# EAGLE design PinJoy (EAGLE 6.1)
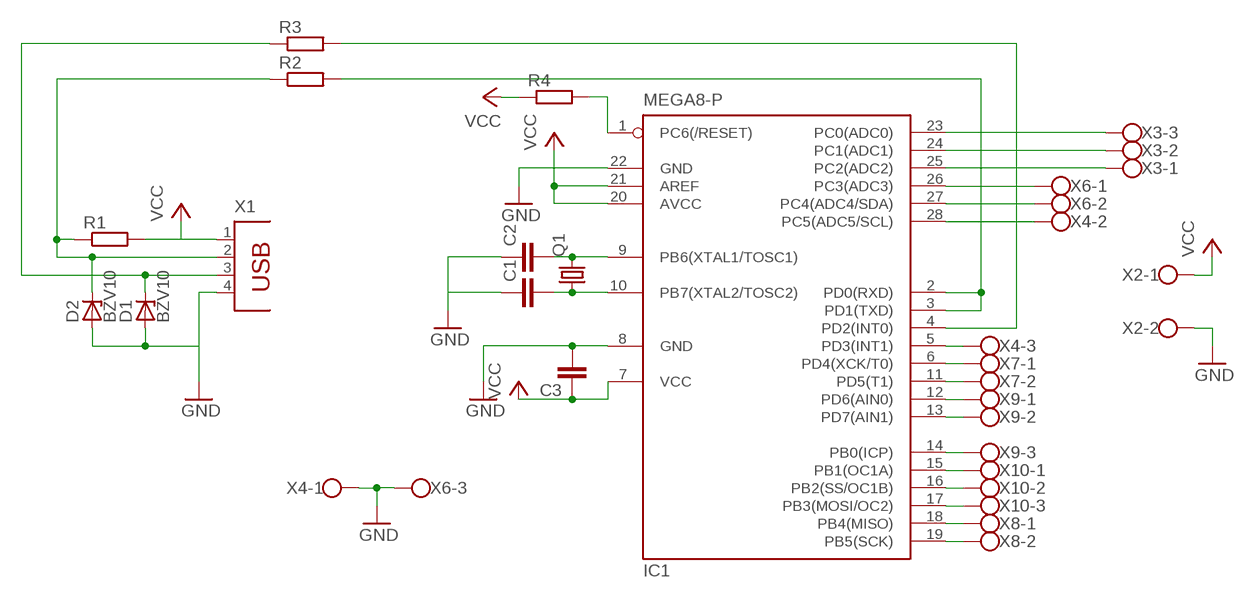
[diagram p0: schematic, sheet 1]

## Parts
C1  C-EU025-024X044  [C025-024X044]
C2  C-EU025-024X044  [C025-024X044]
C3  C-EU025-024X044  [C025-024X044]
D1  BZV10  [DO34Z7]
D2  BZV10  [DO34Z7]
IC1  MEGA8-P  [DIL28-3]
Q1  CRYSTALHC18U-V  [HC18U-V]
R1  R-EU_0204/7  [0204/7]
R2  R-EU_0204/7  [0204/7]
R3  R-EU_0204/7  [0204/7]
R4  R-EU_0204/7  [0204/7]
X1  PN61729  [PN61729]
X2  W237-102  [W237-102]
X3  W237-103  [W237-103]
X4  W237-103  [W237-103]
X6  W237-103  [W237-103]
X7  W237-102  [W237-102]
X8  W237-102  [W237-102]
X9  W237-103  [W237-103]
X10  W237-103  [W237-103]

## Nets
GND: C1.1 C2.1 C3.2 D1.A D2.A IC1.8(GND) IC1.22(GND) X1.4 X2.2 X4.1 X6.3
N$1: C2.2 IC1.9(PB6(XTAL1/TOSC1)) Q1.2
N$2: C1.2 IC1.10(PB7(XTAL2/TOSC2)) Q1.1
N$3: IC1.19(PB5(SCK)) X8.2
N$4: D2.C R1.1 R2.1 X1.2
N$5: IC1.2(PD0(RXD)) IC1.3(PD1(TXD)) R2.2
N$6: IC1.4(PD2(INT0)) R3.2
N$7: D1.C R3.1 X1.3
N$8: IC1.18(PB4(MISO)) X8.1
N$9: IC1.17(PB3(MOSI/OC2)) X10.3
N$10: IC1.25(PC2(ADC2)) X3.1
N$11: IC1.16(PB2(SS/OC1B)) X10.2
N$12: IC1.15(PB1(OC1A)) X10.1
N$13: IC1.24(PC1(ADC1)) X3.2
N$14: IC1.23(PC0(ADC0)) X3.3
N$15: IC1.26(PC3(ADC3)) X6.1
N$16: IC1.27(PC4(ADC4/SDA)) X6.2
N$17: IC1.13(PD7(AIN1)) X9.2
N$18: IC1.12(PD6(AIN0)) X9.1
N$19: IC1.11(PD5(T1)) X7.2
N$20: IC1.6(PD4(XCK/T0)) X7.1
N$21: IC1.5(PD3(INT1)) X4.3
N$22: IC1.28(PC5(ADC5/SCL)) X4.2
N$23: IC1.14(PB0(ICP)) X9.3
N$24: IC1.1(PC6(/RESET)) R4.2
VCC: C3.1 IC1.7(VCC) IC1.20(AVCC) IC1.21(AREF) R1.2 R4.1 X1.1 X2.1

## Library data of the parts
C1-C3 = rcl:C-EU: CAPACITOR, European symbol
D1 D2 = diode:BZV10: Z DIODE
IC1 = atmel:MEGA8-P: MICROCONTROLLER 8 Kbytes FLASH, 1 kbytes SRAM, 512 bytes EEPROM, USART, 4-channel 10 bit ADC, 2-channel 8 bit ADC Pin compatible with Atmega48, ATMega88, ATMega168 Source: avr.lbr; OC_FARNELL: unknown; OC_NEWARK: unknown
Q1 = crystal:CRYSTAL: CRYSTAL; OC_FARNELL: unknown; OC_NEWARK: unknown
R1-R4 = resistor:R-EU_: RESISTOR, European symbol
X1 = con-berg:PN61729: BERG USB connector; OC_FARNELL: unknown; OC_NEWARK: unknown
X2 X7 X8 = con-wago-500:W237-102: WAGO SCREW CLAMP; MPN: 237-102; OC_FARNELL: unknown; OC_NEWARK: 70K9898
X3 X4 X6 X9 X10 = con-wago-500:W237-103: WAGO SCREW CLAMP; MPN: 237-103; OC_FARNELL: unknown; OC_NEWARK: 18M7116

## Board
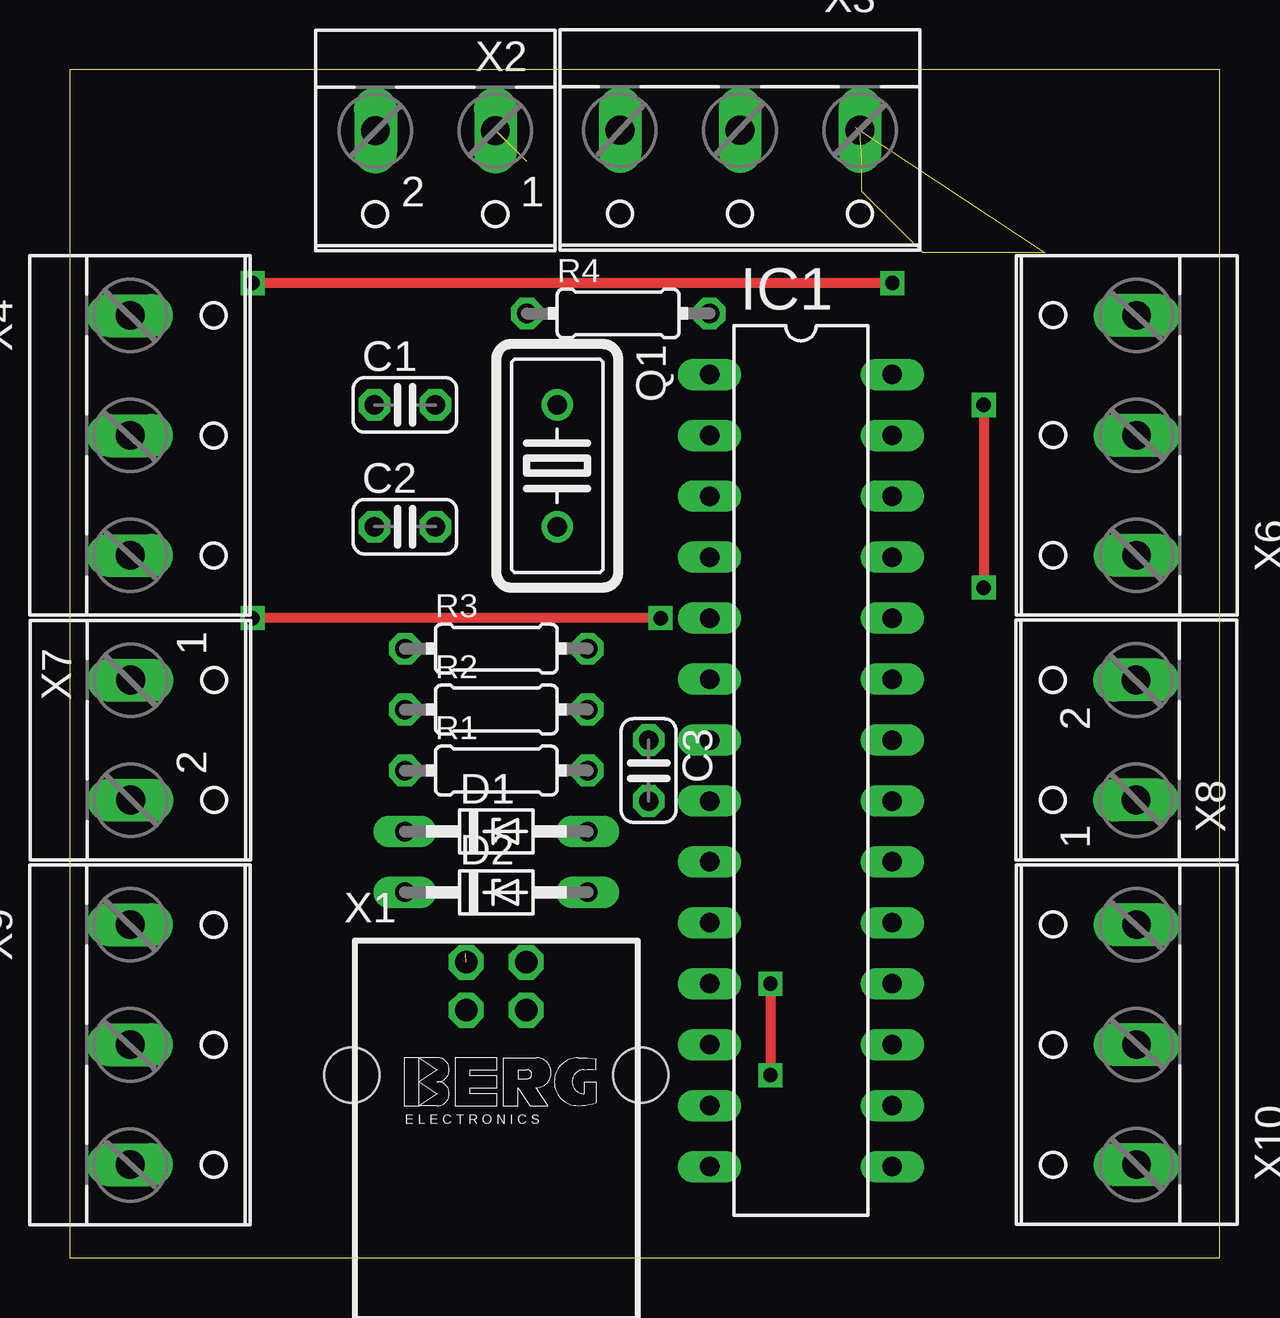
[diagram p1: board, top side]
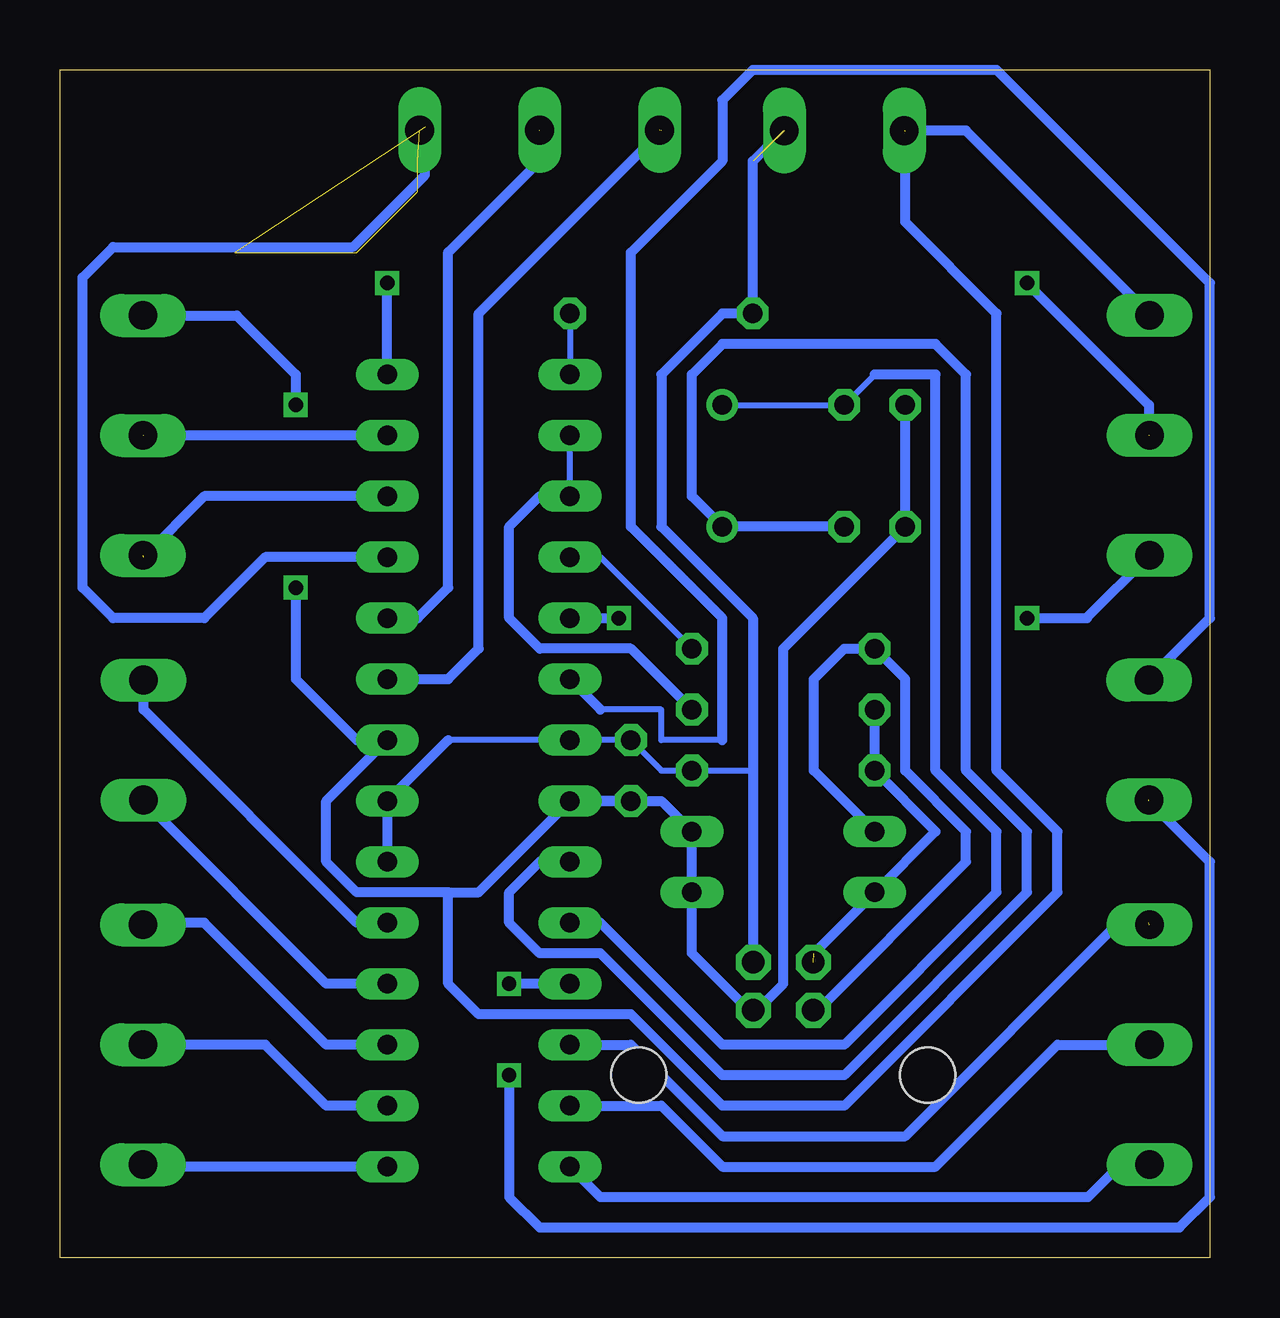
[diagram p2: board, bottom side, seen from below]

Size 47.93 x 49.52 mm. Coordinates in mm from the lower left corner, seen from the top.
Outline: 0,0 47.93,0 47.93,49.52 0,49.52 0,0
Copper layers (1*16): Top 0.035mm / dielectric 1.5mm / Bottom 0.035mm
Design rules: minimum track width 10mil, minimum drill 24mil, track to track 8mil, track to pad 8mil, pad to pad 8mil, via to via 8mil, smd to smd 8mil, copper to edge 40mil, drill to drill 8mil, minimum pad ring 10mil, minimum via ring 8mil, stop-mask expansion 4mil, vias tented up to drill 0mil, thermal gap 10mil

### Footprints (pad centres in the part's own frame; a part is rotated, then mirrored left to right if it is on the bottom)
C025-024X044 = drill 0.813 octagon: 1 -1.27,0; 2 1.27,0
DO34Z7 = drill 0.813 long: A 3.81,0; C -3.81,0
DIL28-3 = drill 0.813 long: 1 -16.51,-3.81; 2 -13.97,-3.81; 3 -11.43,-3.81; 4 -8.89,-3.81; 5 -6.35,-3.81; 6 -3.81,-3.81; 7 -1.27,-3.81; 8 1.27,-3.81; 9 3.81,-3.81; 10 6.35,-3.81; 11 8.89,-3.81; 12 11.43,-3.81; 13 13.97,-3.81; 14 16.51,-3.81; 15 16.51,3.81; 16 13.97,3.81; 17 11.43,3.81; 18 8.89,3.81; 19 6.35,3.81; 20 3.81,3.81; 21 1.27,3.81; 22 -1.27,3.81; 23 -3.81,3.81; 24 -6.35,3.81; 25 -8.89,3.81; 26 -11.43,3.81; 27 -13.97,3.81; 28 -16.51,3.81
HC18U-V = drill 0.813: 1 -2.54,0; 2 2.54,0
0204/7 = drill 0.813 octagon: 1 -3.81,0; 2 3.81,0
PN61729 = drill 0.95 octagon: 1 1.25,4.71; 2 -1.25,4.71; 3 -1.25,2.71; 4 1.25,2.71 | hole 2.3: -6.02,0; 6.02,0
W237-102 = drill 1.194 long: 1 -2.5,-1.27; 2 2.5,-1.27
W237-103 = drill 1.194 long: 1 -5,-1.29; 2 0,-1.29; 3 5,-1.29

### Placement (x,y rotation side)
C1  13.97,35.56 0 top
C2  13.97,30.48 0 top
C3  24.13,20.32 270 top
D1  17.78,17.78 0 top
D2  17.78,15.24 0 top
IC1  30.48,20.32 270 top
Q1  20.32,33.02 270 top
R1  17.78,20.32 0 top
R2  17.78,22.86 0 top
R3  17.78,25.4 0 top
R4  22.86,39.37 0 top
X1  17.78,7.62 0 top
X2  15.24,45.72 180 top
X3  27.94,45.72 180 top
X4  3.81,34.29 270 top
X6  43.18,34.29 90 top
X7  3.81,21.59 270 top
X8  43.18,21.59 90 top
X9  3.81,8.89 270 top
X10  43.18,8.89 90 top

### Tracks (layer width: path | path; a pad name or v marks a point on that pad's centre or on a via)
GND  (via drill 0.6)  (1 unrouted)
  Top 0.406: v38.1,35.56 v38.1,27.94
  Bottom 0.254: 19.05,10.16 X1.4 | 12.7,45.72 X2.2
  Bottom 0.406: 31.75,15.24 31.75,11.43 30.48,10.16 24.13,10.16 20.32,6.35 15.24,6.35 6.35,15.24 6.35,17.78 8.89,20.32 8.89,39.37 12.7,43.18 12.7,45.72 | 31.75,15.24 35.56,15.24 36.83,16.51 36.83,19.05 IC1.22 35.56,21.59 38.1,24.13 v38.1,27.94 | 31.75,15.24 30.48,15.24 IC1.8 | C3.2 IC1.8 | IC1.8 22.86,19.05 D1.A D2.A 21.59,12.7 19.05,10.16 17.78,11.43 17.78,25.4 C2.1 C1.1 | X4.1 2.52,39.35 10.16,46.99 12.7,46.99 | X6.3 40.56,39.29 38.1,36.83 v38.1,35.56
N$1
  Bottom 0.406: IC1.9 27.94,16.51 29.21,15.24 29.21,13.97 27.94,12.7 25.4,12.7 20.32,7.62 15.24,7.62 7.62,15.24 7.62,17.78 10.16,20.32 10.16,36.83 11.43,38.1 20.32,38.1 21.59,36.83 21.59,31.75 Q1.2 C2.2
N$2
  Bottom 0.254: Q1.1 C1.2 13.97,36.83
  Bottom 0.406: 13.97,36.83 11.43,36.83 11.43,20.32 8.89,17.78 8.89,15.24 15.24,8.89 20.32,8.89 25.4,13.97 IC1.10
N$3
  Bottom 0.254: 44.45,24.13 X8.2
  Bottom 0.406: IC1.19 35.56,13.97 44.45,22.86 44.45,24.13
N$4  (1 unrouted)
  Bottom 0.406: 16.51,12.7 D2.C 11.43,17.78 R1.1 R2.1
N$5
  Bottom 0.254: IC1.3 IC1.2
  Bottom 0.406: R2.2 24.13,25.4 27.94,25.4 29.21,26.67 29.21,30.48 27.94,31.75 IC1.3
N$6
  Bottom 0.254: R3.2 25.4,29.21 IC1.4
N$7
  Bottom 0.254: 16.51,10.16 X1.3
  Bottom 0.406: 16.51,10.16 10.16,16.51 10.16,17.78 12.7,20.32 12.7,24.13 R3.1 15.24,25.4 16.51,24.13 16.51,20.32 D1.C
N$8
  Bottom 0.254: 44.45,19.05 X8.1
  Bottom 0.406: IC1.18 36.83,11.43 44.45,19.05
N$9
  Bottom 0.254: 44.45,13.97 X10.3
  Bottom 0.406: IC1.17 36.83,8.89 41.91,13.97 44.45,13.97
N$10  (5 unrouted)
  Bottom 0.406: IC1.25 39.37,29.21 41.91,26.67 45.72,26.67 46.99,27.94 46.99,40.87 45.72,42.14 35.72,42.14 32.72,45.14 32.72,47.14
N$11
  Bottom 0.406: IC1.16 36.83,6.35 39.37,8.89 X10.2
N$12
  Bottom 0.254: 44.45,3.81 X10.1
  Bottom 0.406: IC1.15 44.45,3.81
N$13  (1 unrouted)
  Bottom 0.406: IC1.24 33.02,26.67 31.75,27.94 31.75,41.93 31.73,41.93 27.94,45.72 27.94,46.99
N$14  (1 unrouted)
  Bottom 0.406: IC1.23 31.75,24.13 30.48,25.4 30.48,39.37 22.86,46.99
N$15  (1 unrouted)
  Bottom 0.406: IC1.26 41.91,31.75 44.45,29.21
N$16  (1 unrouted)
  Bottom 0.406: IC1.27 44.45,34.29
N$17
  Bottom 0.406: IC1.13 22.86,6.35 20.32,3.81 11.43,3.81 6.35,8.89 X9.2
N$18  (1 unrouted)
  Bottom 0.406: IC1.12 24.13,8.89 20.32,5.08 12.7,5.08 3.81,13.97 2.54,13.97
N$19  (via drill 0.6)  (1 unrouted)
  Top 0.406: v29.21,11.43 v29.21,7.62
  Bottom 0.406: IC1.11 v29.21,11.43 | v29.21,7.62 29.21,2.54 27.94,1.27 1.27,1.27 0,2.54 0,16.51 2.54,19.05
N$20
  Bottom 0.254: 20.32,21.59 22.86,21.59 22.86,22.86 25.4,22.86
  Bottom 0.406: 20.32,21.59 20.32,26.67 24.13,30.48 24.13,41.91 20.32,45.72 20.32,48.26 19.05,49.53 8.89,49.53 0,40.64 0,26.67 2.54,24.13 X7.1 | 25.4,22.86 IC1.6
N$21  (via drill 0.6)
  Top 0.406: v24.63,26.67 v7.62,26.67
  Bottom 0.406: IC1.5 v24.63,26.67 | v7.62,26.67 5.12,26.67 5.12,26.69 X4.3
N$22  (via drill 0.6)  (1 unrouted)
  Top 0.406: v34.29,40.64 v7.62,40.64
  Bottom 0.406: IC1.28 v34.29,40.64 | v7.62,40.64 2.54,35.56 2.54,34.29
N$23
  Bottom 0.406: X9.3 3.73,3.89 5.08,2.54 25.4,2.54 IC1.14
N$24
  Bottom 0.254: R4.2 IC1.1
VCC  (2 unrouted)
  Bottom 0.254: 19.05,20.32 R1.2 22.86,20.32 C3.1 IC1.7 31.75,21.59 | 19.05,12.7 X1.1
  Bottom 0.406: 31.75,21.59 IC1.21 IC1.20 | 19.05,12.7 19.05,20.32 19.05,26.67 22.86,30.48 22.86,36.83 20.32,39.37 R4.1 19.05,45.72 17.78,46.99